# EAGLE design MCB-NINA-B1-v2.0.0 (EAGLE 7.7.0)

## Sheet 1 of 2
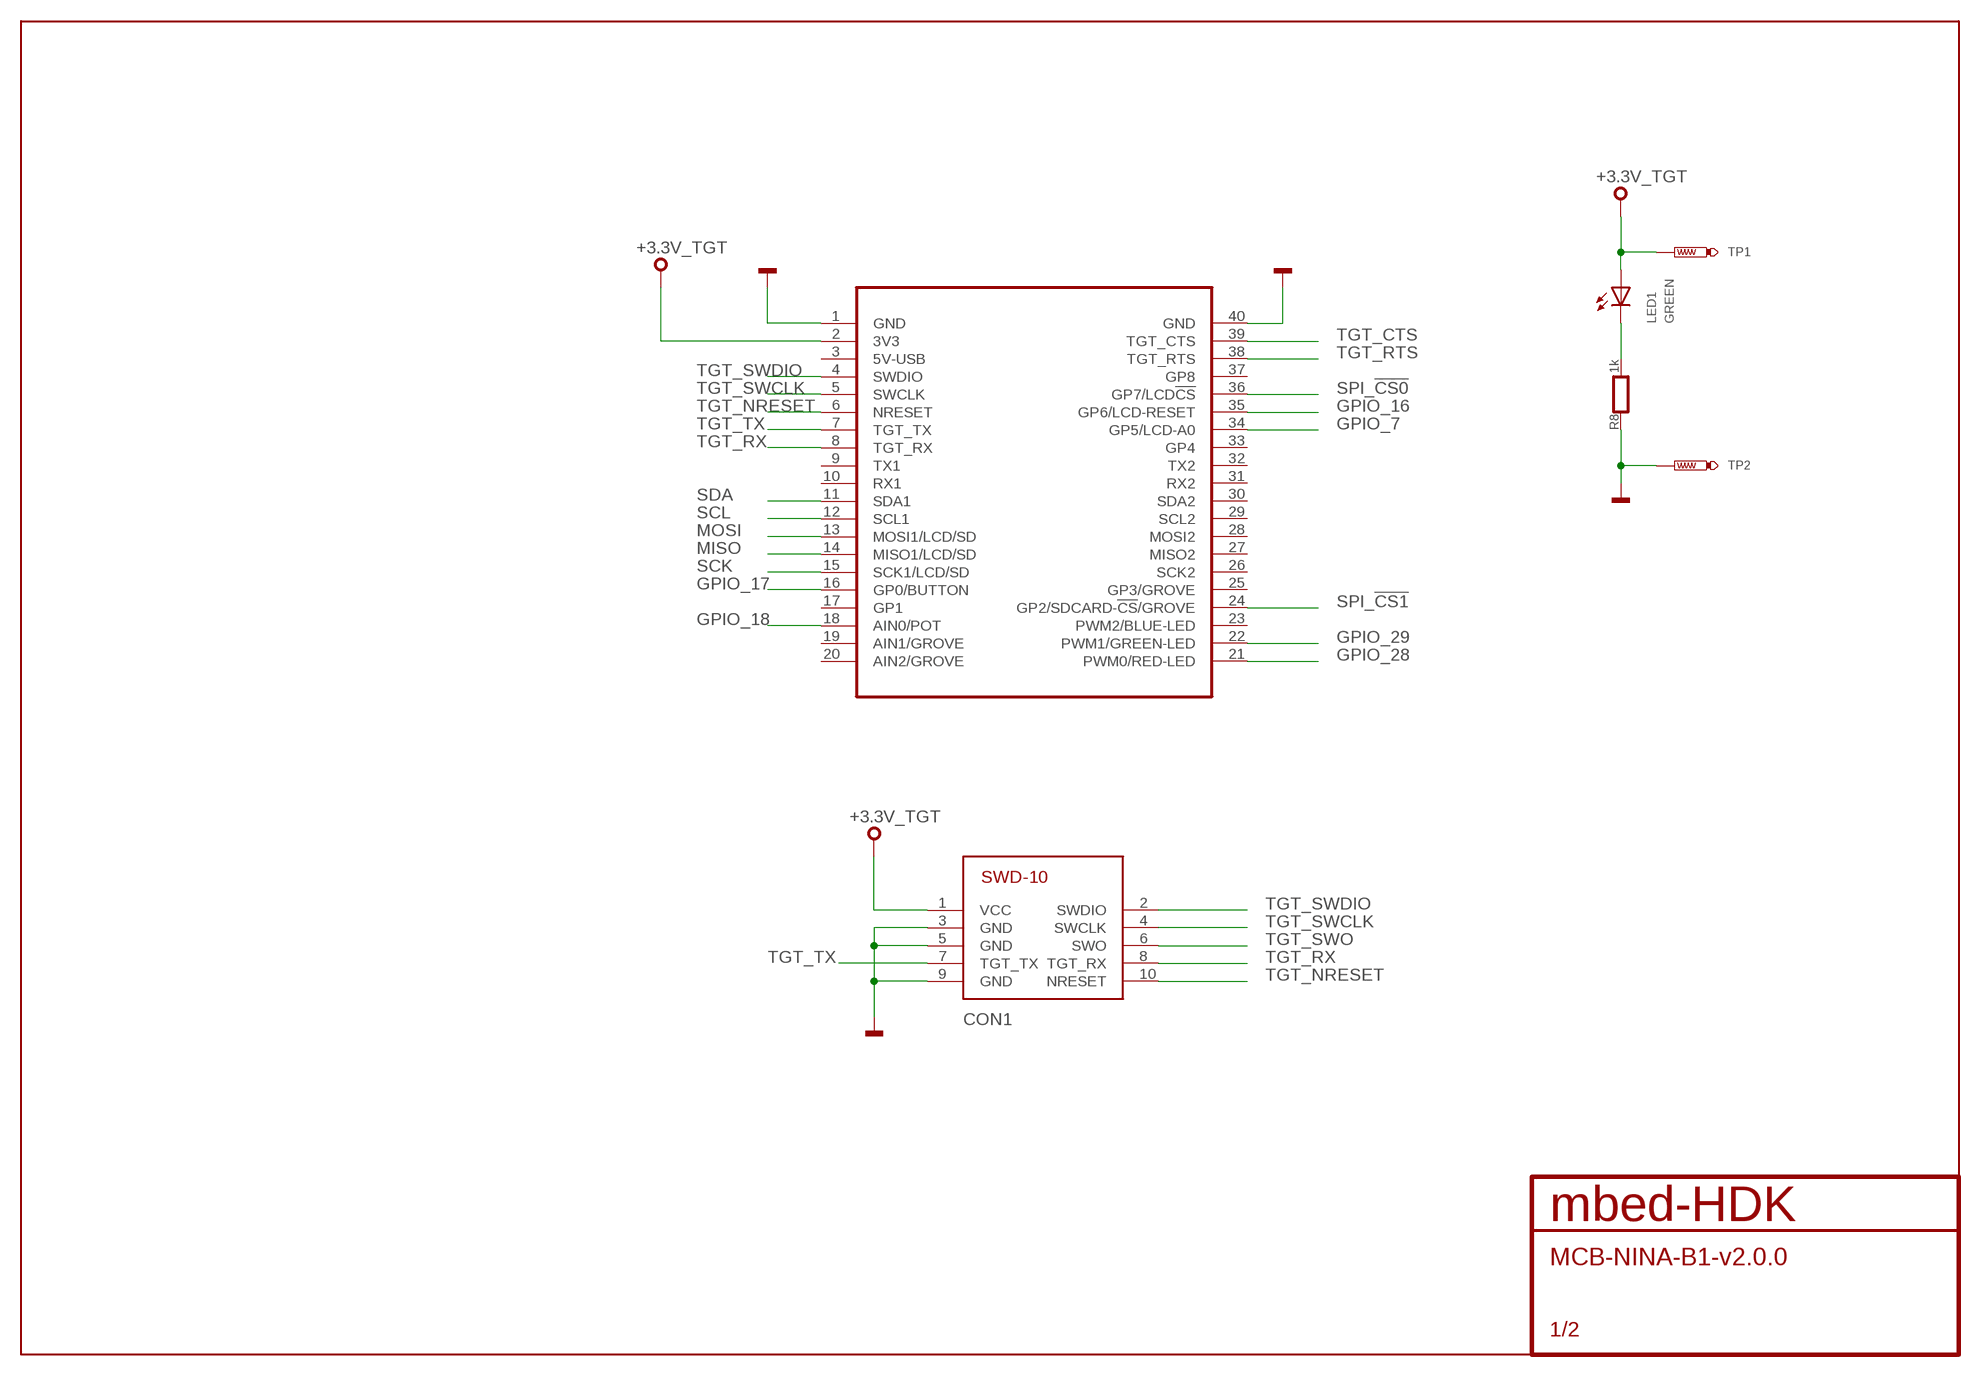
[diagram p0: schematic, sheet 1]

### Parts
CON1  SWD-10/TC2050_SMD  [FTSH-105-02]
LED1  GREEN  SMD_LED0603  [CHIPLED_0603]
MOD1  MODULE_DAUGHTER  [MODULE_DAUGHTER]
R8  1k  RESISTOR0603  [0603]
TP1  TEST-POINT-50R-PTH  [TP50-PTH]
TP2  TEST-POINT-50R-PTH  [TP50-PTH]

### Nets
+3.3V_TGT: CON1.1(VCC) LED1.A MOD1.2(3V3) TP1.TP ; also sheet 2
GND: CON1.3(GND) CON1.5(GND) CON1.9(GND) MOD1.1(GND) MOD1.40(GND) R8.1 TP2.TP ; also sheet 2
GPIO_7: MOD1.34(GP5/LCD-A0) ; also sheet 2
GPIO_16: MOD1.35(GP6/LCD-RESET) ; also sheet 2
GPIO_17: MOD1.16(GP0/BUTTON) ; also sheet 2
GPIO_18: MOD1.18(AIN0/POT) ; also sheet 2
GPIO_28: MOD1.21(PWM0/RED-LED) ; also sheet 2
GPIO_29: MOD1.22(PWM1/GREEN-LED) ; also sheet 2
MISO: MOD1.14(MISO1/LCD/SD) ; also sheet 2
MOSI: MOD1.13(MOSI1/LCD/SD) ; also sheet 2
PA_1: LED1.C R8.2
SCK: MOD1.15(SCK1/LCD/SD) ; also sheet 2
SCL: MOD1.12(SCL1) ; also sheet 2
SDA: MOD1.11(SDA1) ; also sheet 2
SPI_!CS0: MOD1.36(GP7/LCD!CS) ; also sheet 2
SPI_!CS1: MOD1.24(GP2/SDCARD-!CS!/GROVE) ; also sheet 2
TGT_CTS: MOD1.39(TGT_CTS) ; also sheet 2
TGT_NRESET: CON1.10(NRESET) MOD1.6(NRESET) ; also sheet 2
TGT_RTS: MOD1.38(TGT_RTS) ; also sheet 2
TGT_RX: CON1.8(TGT_RX) MOD1.8(TGT_RX) ; also sheet 2
TGT_SWCLK: CON1.4(SWCLK) MOD1.5(SWCLK) ; also sheet 2
TGT_SWDIO: CON1.2(SWDIO) MOD1.4(SWDIO) ; also sheet 2
TGT_SWO: CON1.6(SWO) ; also sheet 2
TGT_TX: CON1.7(TGT_TX) MOD1.7(TGT_TX) ; also sheet 2
Unconnected: MOD1.3(5V-USB) MOD1.9(TX1) MOD1.10(RX1) MOD1.17(GP1) MOD1.19(AIN1/GROVE) MOD1.20(AIN2/GROVE) MOD1.23(PWM2/BLUE-LED) MOD1.25(GP3/GROVE) MOD1.26(SCK2) MOD1.27(MISO2) MOD1.28(MOSI2) MOD1.29(SCL2) MOD1.30(SDA2) MOD1.31(RX2) MOD1.32(TX2) MOD1.33(GP4) MOD1.37(GP8)

## Sheet 2 of 2
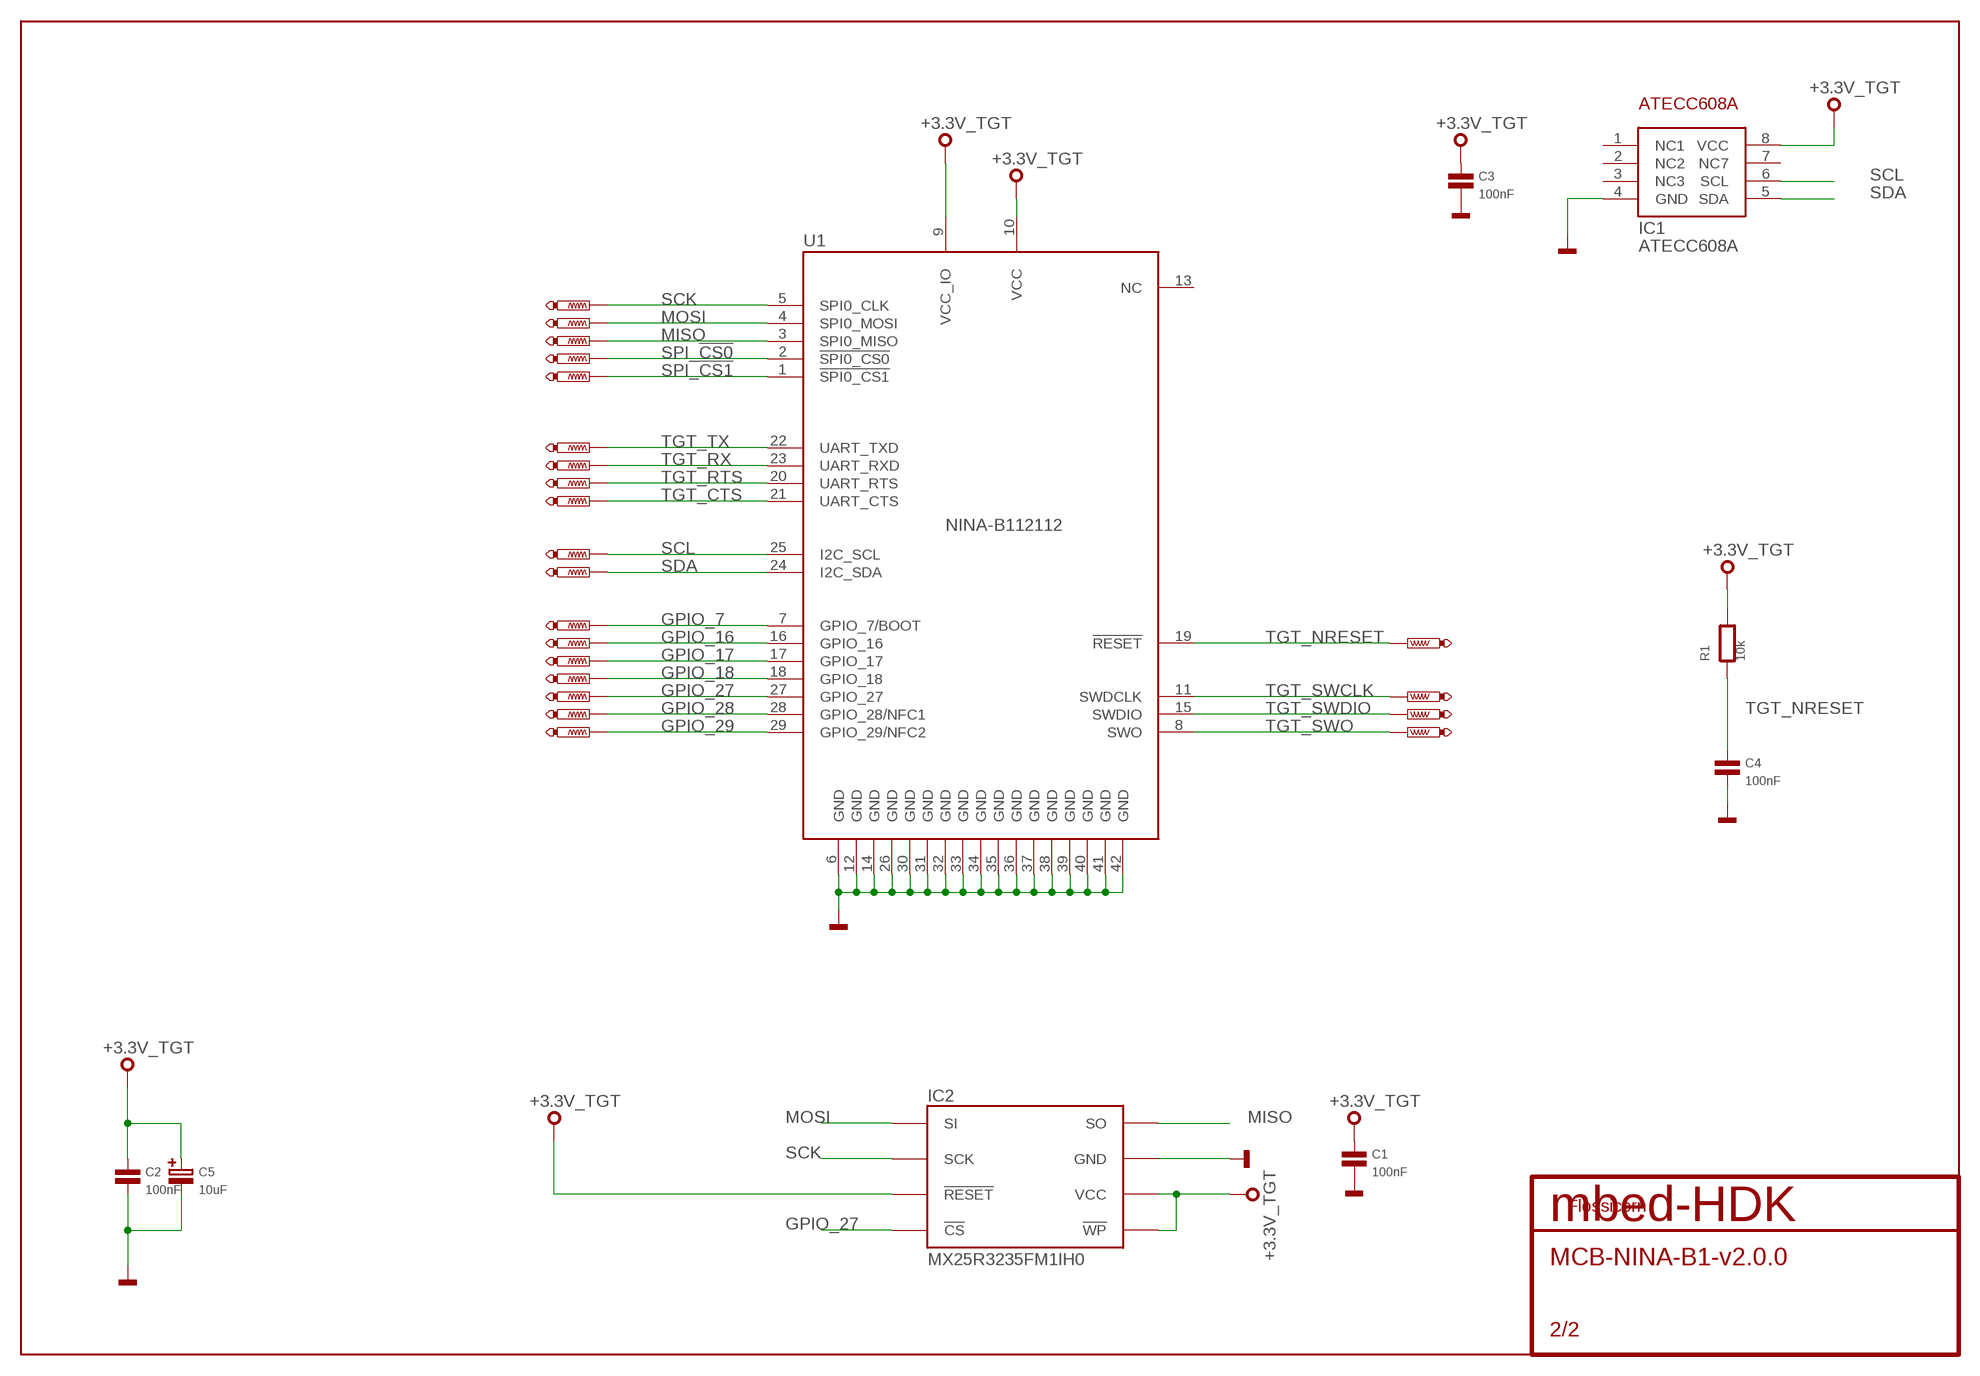
[diagram p1: schematic, sheet 2]

### Parts
C1  100nF  CAPACITOR0603  [0603]
C2  100nF  CAPACITOR0603  [0603]
C3  100nF  CAPACITOR0603  [0603]
C4  100nF  CAPACITOR0603  [0603]
C5  10uF  CAPACITOR-POLARISEDB  [SMC_B]
IC1  ATECC608A  [SO8]
IC2  MX25R3235FM1IH0  [SO8]
R1  10k  RESISTOR0603  [0603]
SS1  FLOSSICORN0.5  [FLOSSICORN-0.5]
TP3  PTR1B1,27  [B1,27]
TP4  PTR1B1,27  [B1,27]
TP5  PTR1B1,27  [B1,27]
TP6  PTR1B1,27  [B1,27]
TP7  PTR1B1,27  [B1,27]
TP8  PTR1B1,27  [B1,27]
TP9  PTR1B1,27  [B1,27]
TP10  PTR1B1,27  [B1,27]
TP11  PTR1B1,27  [B1,27]
TP12  PTR1B1,27  [B1,27]
TP13  PTR1B1,27  [B1,27]
TP14  PTR1B1,27  [B1,27]
TP15  PTR1B1,27  [B1,27]
TP16  PTR1B1,27  [B1,27]
TP17  PTR1B1,27  [B1,27]
TP18  PTR1B1,27  [B1,27]
TP19  PTR1B1,27  [B1,27]
TP20  PTR1B1,27  [B1,27]
TP21  PTR1B1,27  [B1,27]
TP22  PTR1B1,27  [B1,27]
TP23  PTR1B1,27  [B1,27]
TP24  PTR1B1,27  [B1,27]
U1  NINA-B112112  [NINA112-42]

### Nets
+3.3V_TGT: C1.1 C2.1 C3.1 C5.+ IC1.8(VCC) IC2.3(!WP) IC2.7(!RESET) IC2.8(VCC) R1.2 U1.9(VCC_IO) U1.10(VCC) ; also sheet 1
GND: C1.2 C2.2 C3.2 C4.2 C5.- IC1.4(GND) IC2.4(GND) U1.6(GND) U1.12(GND) U1.14(GND) U1.26(GND) U1.30(GND) U1.31(GND) U1.32(GND) U1.33(GND) U1.34(GND) U1.35(GND) U1.36(GND) U1.37(GND) U1.38(GND) U1.39(GND) U1.40(GND) U1.41(GND) U1.42(GND) ; also sheet 1
GPIO_7: TP14.TP U1.7(GPIO_7/BOOT) ; also sheet 1
GPIO_16: TP15.TP U1.16(GPIO_16) ; also sheet 1
GPIO_17: TP16.TP U1.17(GPIO_17) ; also sheet 1
GPIO_18: TP17.TP U1.18(GPIO_18) ; also sheet 1
GPIO_27: IC2.1(!CS) TP18.TP U1.27(GPIO_27)
GPIO_28: TP19.TP U1.28(GPIO_28/NFC1) ; also sheet 1
GPIO_29: TP20.TP U1.29(GPIO_29/NFC2) ; also sheet 1
MISO: IC2.2(SO) TP5.TP U1.3(SPI0_MISO) ; also sheet 1
MOSI: IC2.5(SI) TP4.TP U1.4(SPI0_MOSI) ; also sheet 1
SCK: IC2.6(SCK) TP3.TP U1.5(SPI0_CLK) ; also sheet 1
SCL: IC1.6(SCL) TP12.TP U1.25(I2C_SCL) ; also sheet 1
SDA: IC1.5(SDA) TP13.TP U1.24(I2C_SDA) ; also sheet 1
SPI_!CS0: TP6.TP U1.2(!SPI0_CS0) ; also sheet 1
SPI_!CS1: TP7.TP U1.1(!SPI0_CS1!) ; also sheet 1
TGT_CTS: TP11.TP U1.21(UART_CTS) ; also sheet 1
TGT_NRESET: C4.1 R1.1 TP21.TP U1.19(!RESET) ; also sheet 1
TGT_RTS: TP10.TP U1.20(UART_RTS) ; also sheet 1
TGT_RX: TP9.TP U1.23(UART_RXD) ; also sheet 1
TGT_SWCLK: TP22.TP U1.11(SWDCLK) ; also sheet 1
TGT_SWDIO: TP23.TP U1.15(SWDIO) ; also sheet 1
TGT_SWO: TP24.TP U1.8(SWO) ; also sheet 1
TGT_TX: TP8.TP U1.22(UART_TXD) ; also sheet 1
Unconnected: IC1.1(NC1) IC1.2(NC2) IC1.3(NC3) IC1.7(NC7) U1.13(NC)

## Library data of the parts
C1-C4 = mbed-HDK-RLC:CAPACITOR: Capacitor
C5 = mbed-HDK-RLC:CAPACITOR-POLARISED: Polarised capacitor; MF: Kemet; MFN: T491B106K020AT; OC-DIGIKEY: 399-8298-1-ND; OC-MOUSER: 80-T491B106K020; OC-NEWARK: 57K1740
CON1 = mbed-HDK-Connector:SWD-10/TC2050: 1mm pitch 10-Pin Cortex Programming Header with optional TC2050 footprint solderless interchangeable
IC1 = blackbriar:ATECC608A
IC2 = blackbriar:MX25R3235FM1IH0: Serial Flash 32 Mb 80 Mhz; MF: Macronix; MFN: MX25R3235FM2IH0; OC-DIGIKEY: 1092-1174-ND
LED1 = mbed-HDK-Optical:SMD_LED: LED SMD, Colour Red; MF: Wurth Electronics Inc; MFN: 150060RS75000; OC-DIGIKEY: 732-4978-1-ND; OC-MOUSER: 710-150060RS75000; OC-NEWARK: 2322071
MOD1 = blackbriar:MODULE_DAUGHTER
R1 R8 = mbed-HDK-RLC:RESISTOR: Resistor
SS1 = blackbriar:FLOSSICORN
TP1 TP2 = mbed-HDK:TEST-POINT
TP3-TP24 = blackbriar:PTR1: TEST PIN
U1 = blackbriar:NINA-B112: NINA-B111: BLE stand-alone module u-blox.com

## Board
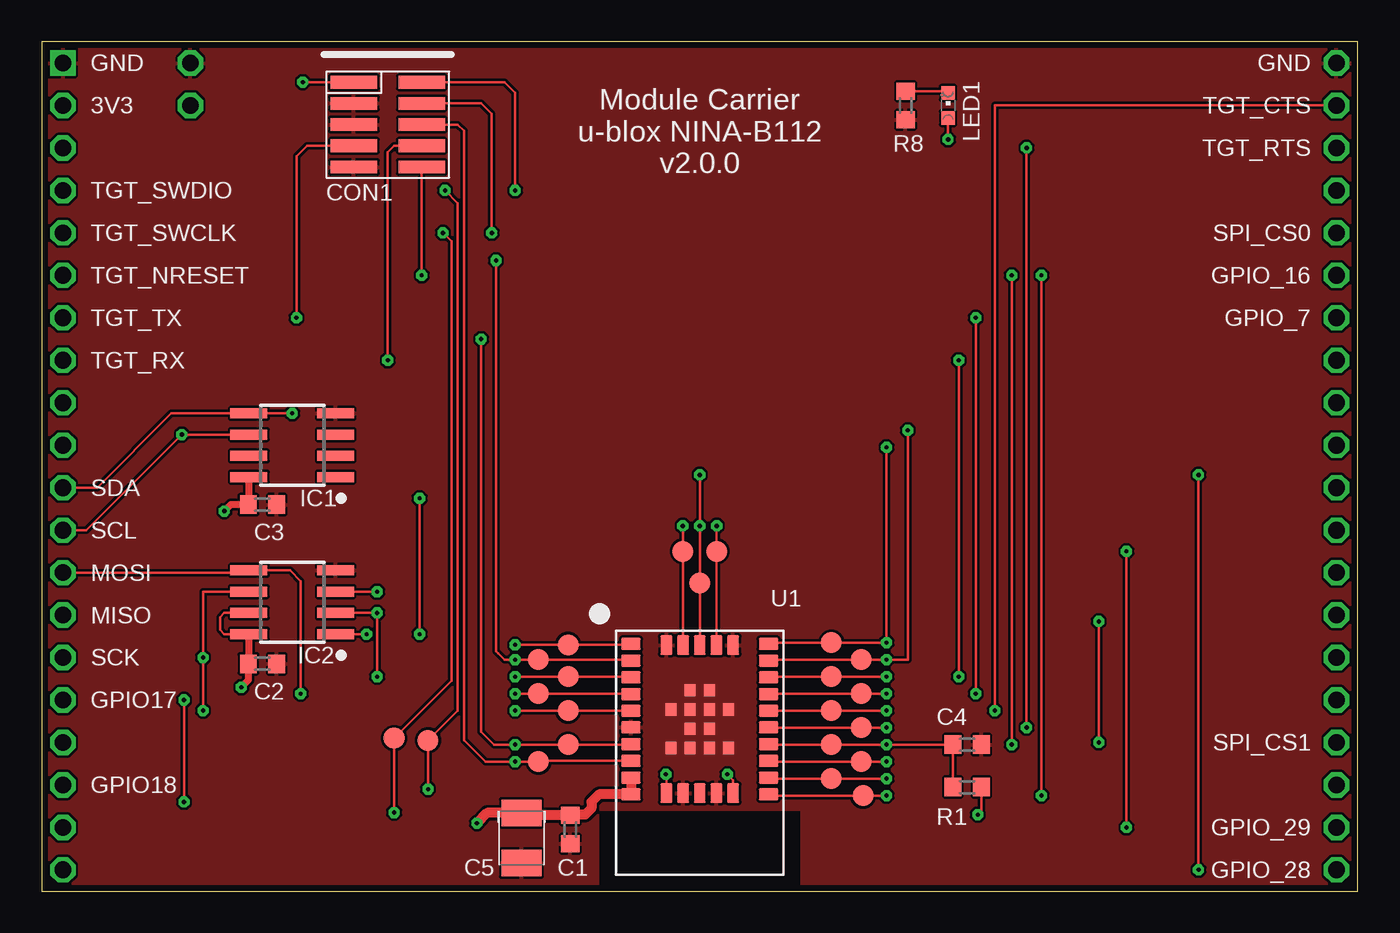
[diagram p2: board, top side]
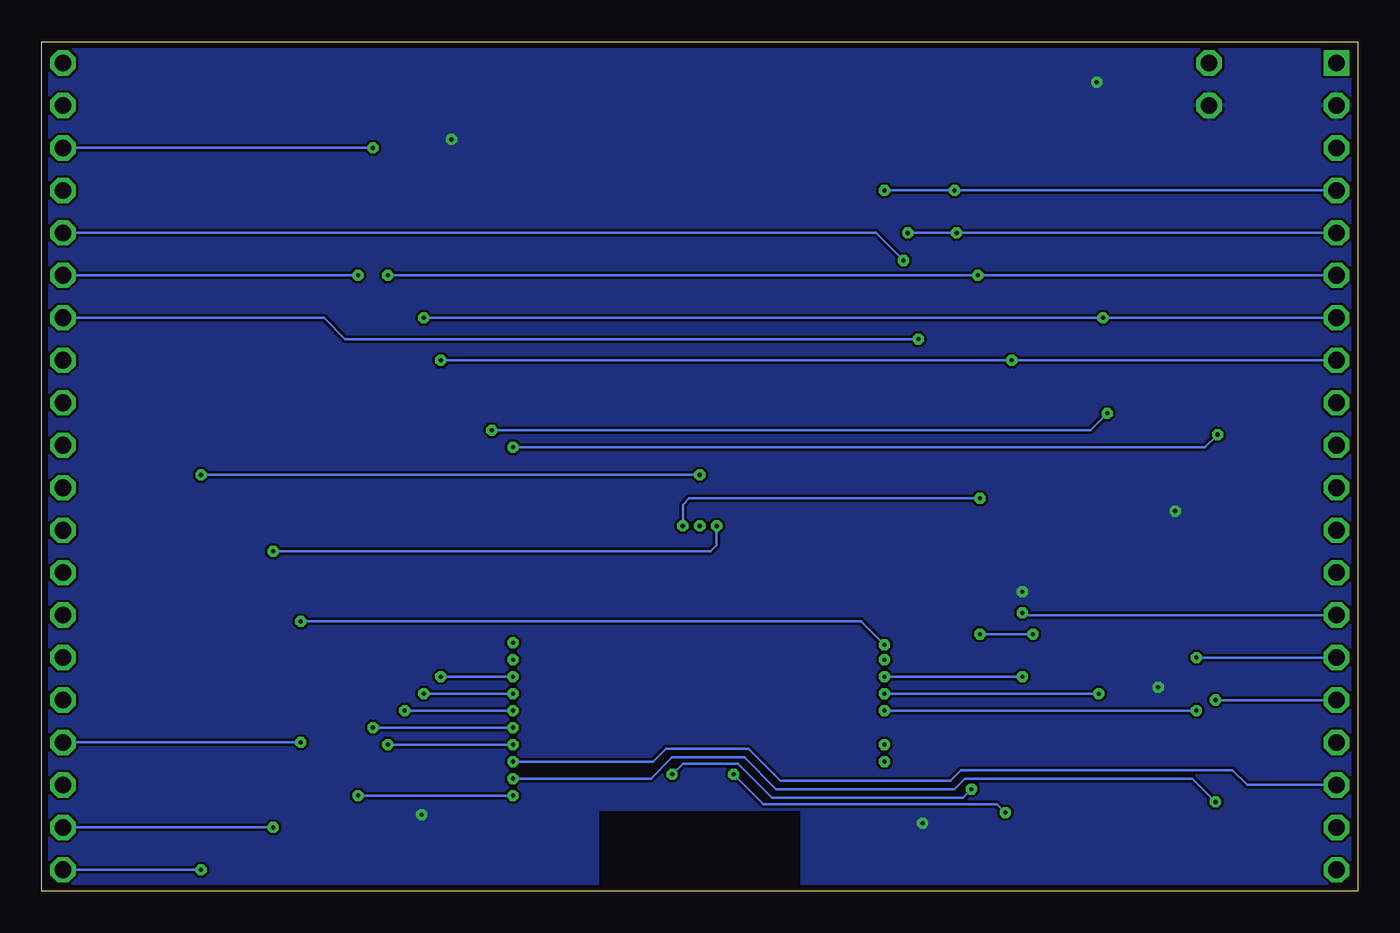
[diagram p3: board, bottom side, seen from below]

Size 78.74 x 50.8 mm. Coordinates in mm from the lower left corner, seen from the top.
Copper layers ((1*16)): Top 0.035mm / dielectric 0.8mm / Bottom 0.035mm
Design rules "mbed-HDK-6-6-2-layer": minimum track width 6mil, minimum drill 9mil, track to track 6mil, track to pad 6mil, pad to pad 6mil, via to via 6mil, smd to smd 6mil, copper to edge 15mil, drill to drill 8mil, minimum pad ring 10mil, minimum via ring 8mil, stop-mask expansion 4mil, vias tented up to drill 0mil, thermal gap 6mil

### Footprints (pad centres in the part's own frame; a part is rotated, then mirrored left to right if it is on the bottom)
0603 = smd 1 x 1.1: 1 -0.85,0; 2 0.85,0
SMC_B = smd 1.6 x 2.4: + -1.5,0; - 1.5,0
FTSH-105-02 = smd 0.762 x 2.794: 1 0.381,-2.032; 2 0.381,2.032; 3 1.651,-2.032; 4 1.651,2.032; 5 2.921,-2.032; 6 2.921,2.032; 7 4.191,-2.032; 8 4.191,2.032; 9 5.461,-2.032; 10 5.461,2.032
SO8 = smd 0.6 x 2.2: 1 -1.905,-2.6; 2 -0.635,-2.6; 3 0.635,-2.6; 4 1.905,-2.6; 5 1.905,2.6; 6 0.635,2.6; 7 -0.635,2.6; 8 -1.905,2.6
CHIPLED_0603 = smd 0.8 x 0.8: A 0,-0.75; C 0,0.75
MODULE_DAUGHTER = drill 1 square: 1 0,0 | drill 1 octagon: 2 0,-2.54; 3 0,-5.08; 4 0,-7.62; 5 0,-10.16; 6 0,-12.7; 7 0,-15.24; 8 0,-17.78; 9 0,-20.32; 10 0,-22.86; 11 0,-25.4; 12 0,-27.94; 13 0,-30.48; 14 0,-33.02; 15 0,-35.56; 16 0,-38.1; 17 0,-40.64; 18 0,-43.18; 19 0,-45.72; 20 0,-48.26; 21 76.2,-48.26; 22 76.2,-45.72; 23 76.2,-43.18; 24 76.2,-40.64; 25 76.2,-38.1; 26 76.2,-35.56; 27 76.2,-33.02; 28 76.2,-30.48; 29 76.2,-27.94; 30 76.2,-25.4; 31 76.2,-22.86; 32 76.2,-20.32; 33 76.2,-17.78; 34 76.2,-15.24; 35 76.2,-12.7; 36 76.2,-10.16; 37 76.2,-7.62; 38 76.2,-5.08; 39 76.2,-2.54; 40 76.2,0
TP50-PTH = drill 1 octagon: TP 0,0
B1,27 = smd 1.27 x 1.27: TP 0,0
NINA112-42 = smd 0.7 x 1.15: 1 -4.5,-4.125; 2 -3.5,-4.125; 3 -2.5,-4.125; 4 -1.5,-4.125; 5 -0.5,-4.125; 6 0.5,-4.125; 7 1.5,-4.125; 8 2.5,-4.125; 9 3.5,-4.125; 10 4.5,-4.125; 16 4.5,4.125; 17 3.5,4.125; 18 2.5,4.125; 19 1.5,4.125; 20 0.5,4.125; 21 -0.5,4.125; 22 -1.5,4.125; 23 -2.5,4.125; 24 -3.5,4.125; 25 -4.5,4.125 | smd 1.15 x 0.7: 11 4.425,-2; 12 4.425,-1; 13 4.425,0; 14 4.425,1; 15 4.425,2; 26 -4.425,2; 27 -4.425,1; 28 -4.425,0; 29 -4.425,-1; 30 -4.425,-2 | smd 0.7 x 0.7: 31 -1.725,-0.575; 32 -1.725,0.575; 33 -0.575,-1.725; 34 -0.575,-0.575; 35 -0.575,0.575; 36 -0.575,1.725; 37 0.575,-0.575; 38 0.575,0.575; 39 1.725,-1.725; 40 1.725,-0.575; 41 1.725,0.575; 42 1.725,1.725

### Placement (x,y rotation side)
C1  31.62,3.68 270 top
C2  13.21,13.59 0 top
C3  13.21,23.11 0 top
C4  55.37,8.76 0 top
C5  28.7,3.18 270 top
CON1  20.7,48.77 270 top
IC1  14.99,26.67 90 top
IC2  14.99,17.27 90 top
LED1  54.23,46.99 0 top
MOD1  1.27,49.53 0 top
R1  55.37,6.22 0 top
R8  51.69,46.99 90 top
SS1  11.94,1.65 0 top
TP1  8.89,46.99 0 top
TP2  8.89,49.53 0 top
TP3  31.5,10.8 270 top
TP4  29.72,11.81 270 top
TP5  31.5,12.83 270 top
TP6  29.72,13.84 270 top
TP7  31.5,14.73 270 top
TP8  49.02,11.81 270 top
TP9  47.24,12.83 270 top
TP10  49.02,9.78 270 top
TP11  47.24,10.8 270 top
TP12  47.24,14.86 270 top
TP13  49.02,13.84 270 top
TP14  31.5,8.76 270 top
TP15  49.15,5.72 270 top
TP16  47.24,6.73 270 top
TP17  49.02,7.75 270 top
TP18  40.39,20.32 270 top
TP19  39.37,18.42 270 top
TP20  38.35,20.32 270 top
TP21  47.24,8.76 270 top
TP22  21.08,9.14 270 top
TP23  23.11,9.02 270 top
TP24  29.72,7.75 270 top
U1  39.37,10.29 270 top

### Tracks (layer width: path | path; a pad name or v marks a point on that pad's centre or on a via)
+3.3V_TGT  (via drill 0.25)
  Top 0.152: R1.2 56.22,4.79 v56.01,4.57 | IC2.7 10.92,16.64 10.67,16.38 10.67,15.62 10.92,15.37 IC2.8 | CON1.1 v15.62,48.39 | LED1.A v54.23,44.96 | IC2.3 v20.07,17.91
  Top 0.406: v11.94,12.19 12.36,12.61 C2.1 12.39,13.62 IC2.8 | IC1.8 12.39,23.14 C3.1 11.3,23.11 v10.92,22.73
  Top 0.61: U1.9 U1.10 33.35,5.79 32.89,5.33 32.89,4.95 32.51,4.57 31.66,4.57 C1.1 28.84,4.53 C5.+ 26.65,4.68 v26.04,4.06
  pour Bottom: 0,0 78.74,0 78.74,50.8 0,50.8
GND
  pour Top: 0,0 78.74,0 78.74,50.8 0,50.8
GPIO_7  (via drill 0.25)
  Top 0.152: U1.7 35.22,8.76 TP14.TP v28.32,8.76 27.05,8.76 26.29,9.52 v26.29,33.02
  Bottom 0.152: MOD1.34 61.85,34.29 60.58,33.02 v26.29,33.02
GPIO_16  (via drill 0.25)
  Top 0.152: U1.16 43.57,5.72 TP15.TP v50.55,5.72 | v59.82,5.72 v59.82,36.83
  Bottom 0.152: v50.55,5.72 v59.82,5.72 | v59.82,36.83 MOD1.35
GPIO_17  (via drill 0.25)
  Top 0.152: U1.17 43.55,6.73 TP16.TP v50.55,6.73 | v8.51,5.33 v8.51,11.43
  Bottom 0.152: v50.55,6.73 42.29,6.73 41.02,8 36.7,8 34.8,6.1 33.27,6.1 24.13,6.1 23.5,6.73 20.57,6.73 9.91,6.73 v8.51,5.33 | v8.51,11.43 MOD1.16
GPIO_18  (via drill 0.25)
  Top 0.152: U1.18 43.54,7.75 TP17.TP v50.55,7.75
  Bottom 0.152: v50.55,7.75 42.16,7.75 41.4,8.51 36.45,8.51 34.93,6.98 34.54,6.6 33.27,6.6 24.38,6.6 23.75,7.24 20.57,7.24 7.49,7.24 6.6,6.35 MOD1.18
GPIO_27  (via drill 0.25)
  Top 0.152: U1.27 40.39,14.73 TP18.TP v40.39,21.84 | IC2.1 v19.43,15.37 | v22.61,15.37 v22.61,23.5
  Bottom 0.152: v19.43,15.37 v22.61,15.37 | v22.61,23.5 40.01,23.5 40.39,23.11 v40.39,21.84
GPIO_28  (via drill 0.25)
  Top 0.152: U1.28 TP19.TP v39.37,21.84 v39.37,24.89 | v69.21,1.27 v69.21,24.89
  Bottom 0.152: MOD1.21 v69.21,1.27 | v69.21,24.89 v39.37,24.89
GPIO_29  (via drill 0.25)
  Top 0.152: U1.29 38.35,14.73 TP20.TP v38.35,21.84 | v64.9,20.32 v64.9,3.81
  Bottom 0.152: v38.35,21.84 38.35,20.7 38.74,20.32 v64.9,20.32 | v64.9,3.81 MOD1.22
MISO  (via drill 0.25)
  Top 0.152: U1.3 35.21,12.83 TP5.TP v28.32,12.83 | v20.07,12.83 v20.07,16.64 IC2.2
  Bottom 0.152: MOD1.14 20.07,16.51 v20.07,16.64 | v20.07,12.83 v28.32,12.83
MOSI  (via drill 0.25)
  Top 0.152: U1.4 35.22,11.81 TP4.TP v28.32,11.81 | v15.49,11.81 15.49,12.45 15.49,18.54 14.86,19.18 IC2.5 12.26,19.05 MOD1.13
  Bottom 0.152: v28.32,11.81 v15.49,11.81
PA_1
  Top 0.152: R8.2 54.13,47.84 LED1.C
SCK  (via drill 0.25)
  Top 0.152: U1.5 35.24,10.8 TP3.TP v28.32,10.8 | v9.65,10.8 v9.65,13.97 9.65,17.91 IC2.6
  Bottom 0.152: v28.32,10.8 v9.65,10.8 | MOD1.15 v9.65,13.97
SCL  (via drill 0.25)
  Top 0.152: U1.25 43.57,14.86 TP12.TP v50.55,14.86 v50.55,26.54 | MOD1.12 2.67,21.59 v8.38,27.3 IC1.6
  Bottom 0.152: v50.55,26.54 23.5,26.54 9.14,26.54 v8.38,27.3
SDA  (via drill 0.25)
  Top 0.152: U1.24 43.55,13.84 TP13.TP v50.55,13.84 51.82,13.84 v51.82,27.56 | MOD1.11 3.3,24.13 7.75,28.58 IC1.5 13.72,28.58 v14.99,28.58
  Bottom 0.152: v51.82,27.56 16,27.56 v14.99,28.58
SPI_!CS0  (via drill 0.25)
  Top 0.152: U1.2 35.19,13.84 TP6.TP v28.32,13.84 27.69,13.84 27.3,14.22 27.18,14.35 v27.18,37.72
  Bottom 0.152: MOD1.36 28.83,39.37 v27.18,37.72
SPI_!CS1  (via drill 0.25)
  Top 0.152: U1.1 35.19,14.73 TP7.TP v28.32,14.73 | v63.25,16.13 63.25,9.65 v63.25,8.89
  Bottom 0.152: v28.32,14.73 29.72,16.13 v63.25,16.13 | v63.25,8.89 MOD1.24
TGT_CTS  (via drill 0.25)
  Top 0.152: U1.21 TP11.TP v50.55,10.8 | v57.02,10.8 57.02,46.99 MOD1.39
  Bottom 0.152: v50.55,10.8 v57.02,10.8
TGT_NRESET  (via drill 0.25)
  Top 0.152: U1.19 43.52,8.76 TP21.TP v50.55,8.76 C4.1 R1.1 | v58.04,36.83 v58.04,8.76 | CON1.10 v22.73,36.83
  Bottom 0.152: MOD1.6 v22.73,36.83 56.9,36.83 v58.04,36.83 | v58.04,8.76 53.34,8.76 v50.55,8.76
TGT_RTS  (via drill 0.25)
  Top 0.152: U1.20 TP10.TP v50.55,9.78 | v58.93,9.78 v58.93,44.45
  Bottom 0.152: v50.55,9.78 v58.93,9.78 | v58.93,44.45 MOD1.38
TGT_RX  (via drill 0.25)
  Top 0.152: U1.23 43.54,12.83 TP9.TP v50.55,12.83 | v54.86,12.83 v54.86,31.75 | CON1.8 21.08,44.58 20.7,44.2 v20.7,31.75
  Bottom 0.152: MOD1.8 v20.7,31.75 v54.86,31.75 | v50.55,12.83 v54.86,12.83
TGT_SWCLK  (via drill 0.25)
  Top 0.152: U1.11 37.37,6.95 v37.34,6.98 | v21.08,4.7 TP22.TP 24.51,12.57 24.51,13.59 24.51,38.86 v24,39.37 | CON1.4 26.29,47.12 26.92,46.48 v26.92,39.37
  Bottom 0.152: MOD1.5 23.5,39.37 v24,39.37 26.42,39.37 v26.92,39.37 | v37.34,6.98 35.56,5.21 21.84,5.21 21.59,5.21 v21.08,4.7
TGT_SWDIO  (via drill 0.25)
  Top 0.152: U1.15 41.37,6.64 v41.02,6.98 | v23.11,6.1 TP23.TP 24.89,10.8 24.89,11.18 24.89,41.15 v24.13,41.91 | CON1.2 27.69,48.39 28.32,47.75 v28.32,41.91
  Bottom 0.152: MOD1.4 v24.13,41.91 25.15,41.91 v28.32,41.91 | v41.02,6.98 40.39,7.62 37.08,7.62 35.05,5.59 33.91,5.59 23.62,5.59 v23.11,6.1
TGT_SWO  (via drill 0.25)
  Top 0.152: U1.8 29.76,7.79 TP24.TP v28.32,7.75 26.92,7.75 26.54,7.75 25.27,9.02 25.27,45.47 24.89,45.85 CON1.6
TGT_TX  (via drill 0.25)
  Top 0.152: U1.22 43.52,11.81 TP8.TP v50.55,11.81 | v55.88,11.81 v55.88,34.29 | CON1.7 15.88,44.58 15.24,43.94 v15.24,34.29
  Bottom 0.152: MOD1.7 v15.24,34.29 v55.88,34.29 | v50.55,11.81 v55.88,11.81

### Text on the board
tPlace: GND / 3V3 / / TGT_SWDIO / TGT_SWCLK / TGT_NRESET / TGT_TX / TGT_RX / / / SDA / SCL / MOSI / MISO / SCK / GPIO17 / / GPIO18 | GND / TGT_CTS / TGT_RTS / / SPI_CS0 / GPIO_16 / GPIO_7 / / / / / / / / / / SPI_CS1 / / GPIO_29 / GPIO_28 | Module Carrier / u-blox NINA-B112 / v2.0.0